# EAGLE design Circuit (EAGLE 7.2.0)
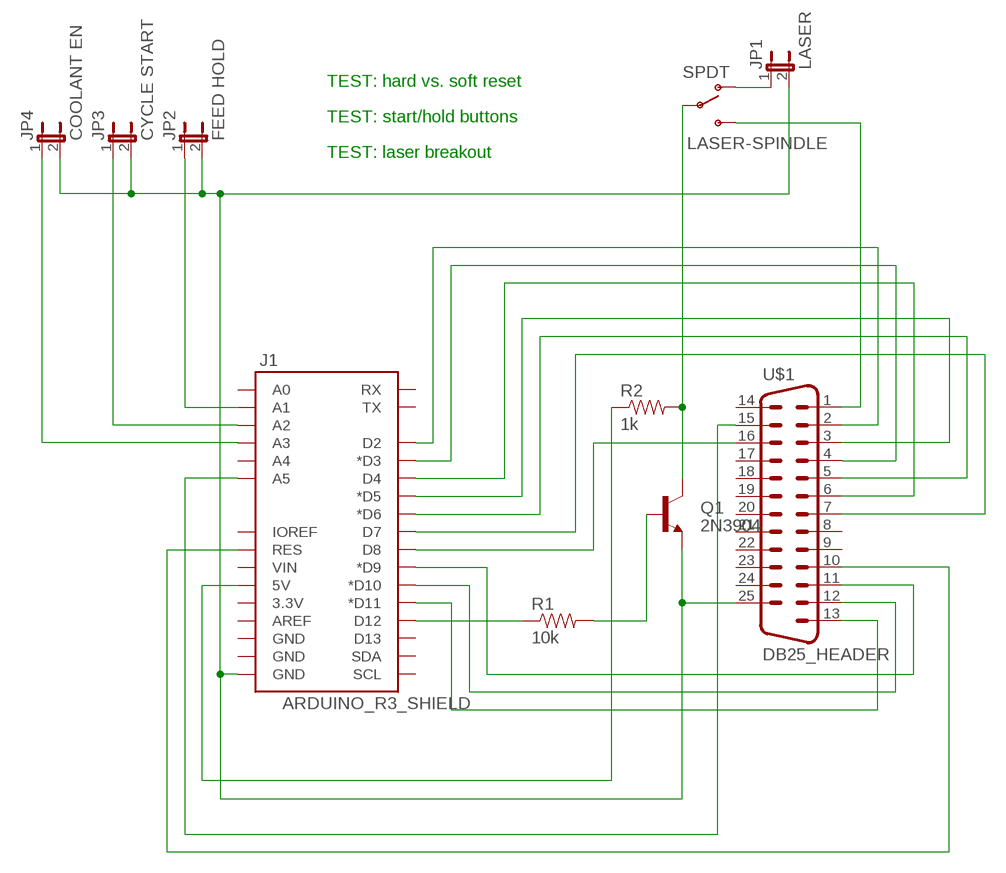
[diagram p0: schematic, sheet 1]

## Parts
J1  ARDUINO_R3_SHIELD  [UNO_R3_SHIELD]
JP1  LASER  JUMPER-2PTH  [1X02]
JP2  FEED HOLD  JUMPER-2PTH  [1X02]
JP3  CYCLE START  JUMPER-2PTH  [1X02]
JP4  COOLANT EN  JUMPER-2PTH  [1X02]
LASER-SPINDLE  SPDT  SWITCH-SPDTPTH  [SWITCH-SPDT]
Q1  2N3904  TRANSISTOR_NPNBC547  [TO-92-AMMO]
R1  10k  RESISTORPTH-1/4W  [AXIAL-0.4]
R2  1k  RESISTORPTH-1/4W  [AXIAL-0.4]
U$1  DB25_HEADER  [DB25_HEADER]

## Nets
N$1: J1.RES U$1.10
N$2: J1.A5 U$1.15
N$3: J1.D2 U$1.2
N$4: J1.D3(*D3) U$1.4
N$5: J1.D4 U$1.6
N$6: J1.D5(*D5) U$1.3
N$7: J1.D6(*D6) U$1.5
N$8: J1.D7 U$1.7
N$9: J1.D8 U$1.16
N$10: LASER-SPINDLE.2(P) Q1.1(C) R2.P$2
N$11: J1.D9(*D9) U$1.11
N$12: J1.D10(*D10) U$1.12
N$13: J1.D11(*D11) U$1.13
N$14: J1.A2 JP3.1
N$15: Q1.2(B) R1.P$2
N$16: J1.D12 R1.P$1
N$17: J1.5V R2.P$1
N$18: LASER-SPINDLE.3(S) U$1.1
N$19: J1.A1 JP2.1
N$20: JP1.1 LASER-SPINDLE.1(O)
N$21: J1.GND@0(GND) JP1.2 JP2.2 JP3.2 JP4.2 Q1.3(E) U$1.25
N$22: J1.A3 JP4.1
Unconnected: J1.3.3V J1.A0 J1.A4 J1.AREF J1.D13 J1.GND@1(GND) J1.GND@2(GND) J1.IOREF J1.RX J1.SCL J1.SDA J1.TX J1.VIN U$1.8 U$1.9 U$1.14 U$1.17 U$1.18 U$1.19 U$1.20 U$1.21 U$1.22 U$1.23 U$1.24

## Notes on the sheet
- TEST: hard vs. soft reset
- TEST: start/hold buttons
- TEST: laser breakout

## Library data of the parts
J1 = SparkFun-Boards:ARDUINO_R3_SHIELD: Shield form compatible with the Arduino Uno R3.
JP1-JP4 = SparkFun-Retired:JUMPER-2: Jumper Basic 0.1" spaced jumper. Use with breakaway headers.
LASER-SPINDLE = SparkFun-Electromechanical:SWITCH-SPDT: SPDT Switch Simple slide switch, Spark Fun Electronics SKU : COM-00102 DPDT SMT slide switch, AYZ0202, SWCH-08179; PROD_ID: SWCH-08261
Q1 = SparkFun-DiscreteSemi:TRANSISTOR_NPN: Generic NPN BJT MMBT2222A - TRANS-08049 (SOT-23, 1A 40V) MPSA42 - TRANS-09116 (SOT-23, 500mA 300V) MMBT5088LT1G - TRANS-11160 (SOT-23, 50 mA 30V) BC547 - COM-08928 <http://www.sparkfun.com/products/8928> (TO-92 45V 100mA) (1.Collector 2.Base 3.Emitter) 2N3904 - COM-00521 <http://www.sparkfun.com/products/521> (TO-92 40V 200mA) (1.Emitter 2.Base 3.Collector) P2N2222A - COM-12852 <http://www.sparkfun.com/products/12852> (TO-92 40V 600mA) (1.Collector 2.Base 3.Emitter)
R1 R2 = SparkFun-Passives:RESISTOR: Resistor Basic schematic elements and footprints for 0603, 1206, and PTH resistors.
U$1 = Custom Library:DB25_HEADER

## Board
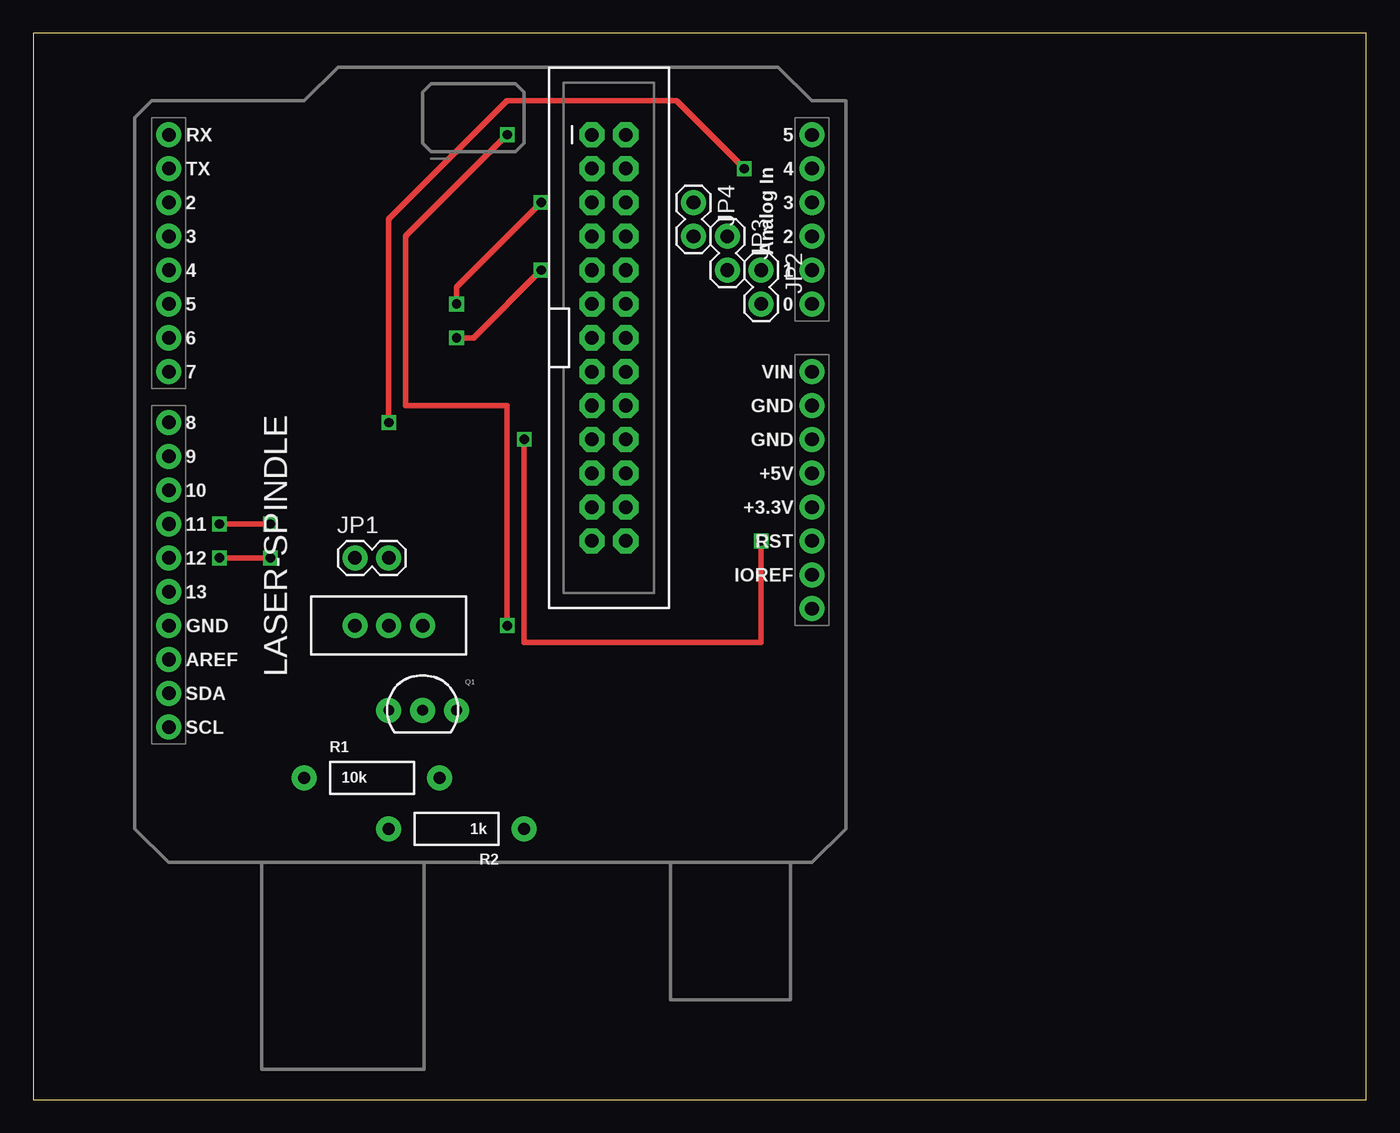
[diagram p1: board, top side]
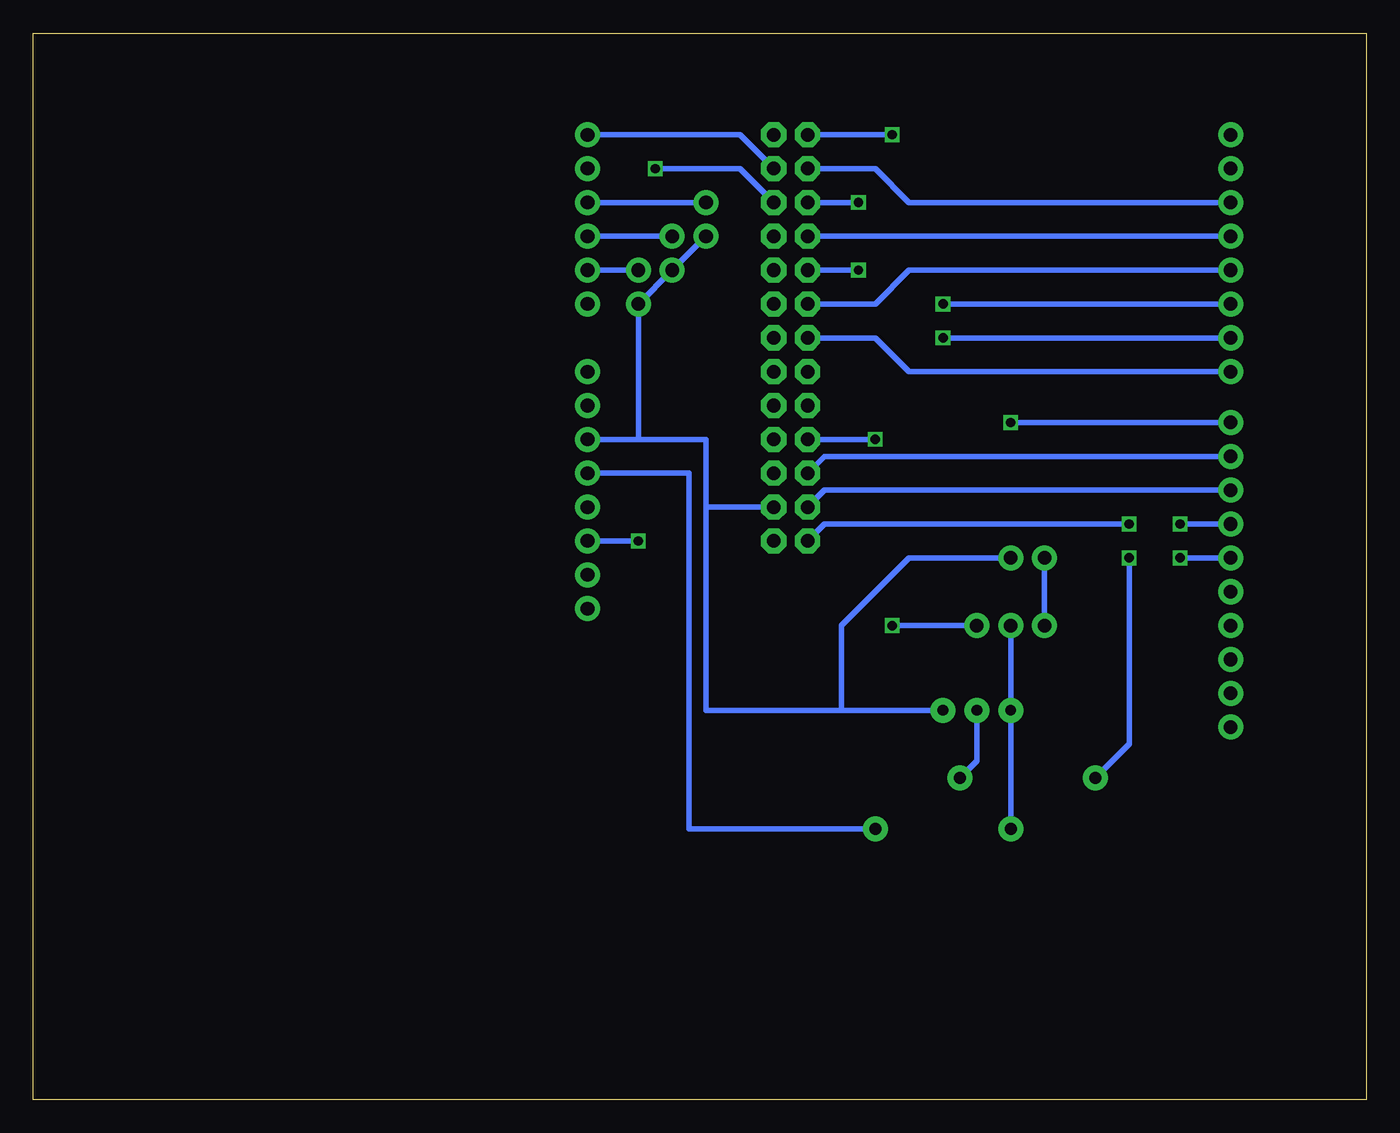
[diagram p2: board, bottom side, seen from below]

Size 100 x 80 mm. Coordinates in mm from the lower left corner, seen from the top.
Outline: 0,0 100,0 100,80 0,80 0,0
Copper layers (1*16): Top 0.035mm / dielectric 1.5mm / Bottom 0.035mm
Design rules "default": minimum track width 10mil, minimum drill 24mil, track to track 8mil, track to pad 8mil, pad to pad 8mil, via to via 8mil, smd to smd 8mil, copper to edge 40mil, drill to drill 8mil, minimum pad ring 10mil, minimum via ring 8mil, stop-mask expansion 4mil, vias tented up to drill 0mil, thermal gap 10mil

### Footprints (pad centres in the part's own frame; a part is rotated, then mirrored left to right if it is on the bottom)
UNO_R3_SHIELD = drill 1.016 pad 1.88: 3.3V 50.8,26.67; 5V 50.8,29.21; A0 50.8,41.91; A1 50.8,44.45; A2 50.8,46.99; A3 50.8,49.53; A4 50.8,52.07; A5 50.8,54.61; AREF 2.54,15.24; D2 2.54,49.53; D3 2.54,46.99; D4 2.54,44.45; D5 2.54,41.91; D6 2.54,39.37; D7 2.54,36.83; D8 2.54,33.02; D9 2.54,30.48; D10 2.54,27.94; D11 2.54,25.4; D12 2.54,22.86; D13 2.54,20.32; GND@0 50.8,31.75; GND@1 50.8,34.29; GND@2 2.54,17.78; IOREF 50.8,21.59; NC 50.8,19.05; RES 50.8,24.13; RX 2.54,54.61; SCL 2.54,10.16; SDA 2.54,12.7; TX 2.54,52.07; VIN 50.8,36.83
1X02 = drill 1.016 pad 1.88: 1 0,0; 2 2.54,0
SWITCH-SPDT = drill 1.016 pad 1.88: 1 0,2.54; 2 0,0; 3 0,-2.54
TO-92-AMMO = drill 0.813 pad 1.88: 1 -2.54,0; 2 0,0; 3 2.54,0
AXIAL-0.4 = drill 0.9 pad 1.88: P$1 -5.08,0; P$2 5.08,0
DB25_HEADER = drill 1.016 pad 1.88 octagon: 1 -1.27,15.24; 2 -1.27,12.7; 3 -1.27,10.16; 4 -1.27,7.62; 5 -1.27,5.08; 6 -1.27,2.54; 7 -1.27,0; 8 -1.27,-2.54; 9 -1.27,-5.08; 10 -1.27,-7.62; 11 -1.27,-10.16; 12 -1.27,-12.7; 13 -1.27,-15.24; 14 1.27,15.24; 15 1.27,12.7; 16 1.27,10.16; 17 1.27,7.62; 18 1.27,5.08; 19 1.27,2.54; 20 1.27,0; 21 1.27,-2.54; 22 1.27,-5.08; 23 1.27,-7.62; 24 1.27,-10.16; 25 1.27,-12.7; 26 1.27,-15.24

### Placement (x,y rotation side)
J1  7.62,17.78 0 top
JP1  24.13,40.64 0 top
JP2  54.61,62.23 270 top
JP3  52.07,64.77 270 top
JP4  49.53,67.31 270 top
LASER-SPINDLE  26.67,35.56 90 top
Q1  29.21,29.21 0 top
R1  25.4,24.13 0 top
R2  31.75,20.32 180 top
U$1  43.18,57.15 0 top

### Tracks (layer width: path | path; a pad name or v marks a point on that pad's centre or on a via)
N$1  (via drill 0.7)
  Top 0.406: v36.83,49.53 36.83,34.29 54.61,34.29 v54.61,41.91
  Bottom 0.406: U$1.10 v36.83,49.53 | J1.RES v54.61,41.91
N$2
  Bottom 0.406: J1.A5 46.99,72.39 U$1.15
N$3
  Bottom 0.406: J1.D2 34.29,67.31 36.83,69.85 U$1.2
N$4
  Bottom 0.406: J1.D3 U$1.4
N$5
  Bottom 0.406: J1.D4 34.29,62.23 36.83,59.69 U$1.6
N$6  (via drill 0.7)
  Top 0.406: v31.75,59.69 31.75,60.96 v38.1,67.31
  Bottom 0.406: J1.D5 v31.75,59.69 | v38.1,67.31 U$1.3
N$7  (via drill 0.7)
  Top 0.406: v31.75,57.15 33.02,57.15 v38.1,62.23
  Bottom 0.406: J1.D6 v31.75,57.15 | v38.1,62.23 U$1.5
N$8
  Bottom 0.406: J1.D7 34.29,54.61 36.83,57.15 U$1.7
N$9  (via drill 0.7)
  Top 0.406: v26.67,50.8 26.67,66.04 35.56,74.93 48.26,74.93 v53.34,69.85
  Bottom 0.406: J1.D8 v26.67,50.8 | v53.34,69.85 46.99,69.85 U$1.16
N$10
  Bottom 0.406: LASER-SPINDLE.2 Q1.1 R2.P$2
N$11
  Bottom 0.406: J1.D9 40.64,48.26 U$1.11
N$12
  Bottom 0.406: J1.D10 40.64,45.72 U$1.12
N$13  (via drill 0.7)
  Top 0.406: v13.97,43.18 v17.78,43.18
  Bottom 0.406: J1.D11 v13.97,43.18 | v17.78,43.18 40.64,43.18 U$1.13
N$14
  Bottom 0.406: J1.A2 JP3.1
N$15
  Bottom 0.406: Q1.2 29.21,25.4 R1.P$2
N$16  (via drill 0.7)
  Top 0.406: v13.97,40.64 v17.78,40.64
  Bottom 0.406: J1.D12 v13.97,40.64 | v17.78,40.64 17.78,26.67 R1.P$1
N$17
  Bottom 0.406: R2.P$1 50.8,20.32 50.8,46.99 J1.5V
N$18  (via drill 0.7)
  Top 0.406: v35.56,35.56 35.56,52.07 27.94,52.07 27.94,64.77 v35.56,72.39
  Bottom 0.406: LASER-SPINDLE.3 v35.56,35.56 | v35.56,72.39 U$1.1
N$19
  Bottom 0.406: J1.A1 JP2.1
N$20
  Bottom 0.406: LASER-SPINDLE.1 JP1.1
N$21
  Bottom 0.406: 49.53,44.45 49.53,29.21 39.37,29.21 | 39.37,29.21 Q1.3 | JP1.2 34.29,40.64 39.37,35.56 39.37,29.21 | U$1.25 49.53,44.45 | 54.61,49.53 JP2.2 JP3.2 JP4.2 | J1.GND@0 54.61,49.53 | 54.61,49.53 49.53,49.53 49.53,44.45
N$22
  Bottom 0.406: J1.A3 JP4.1